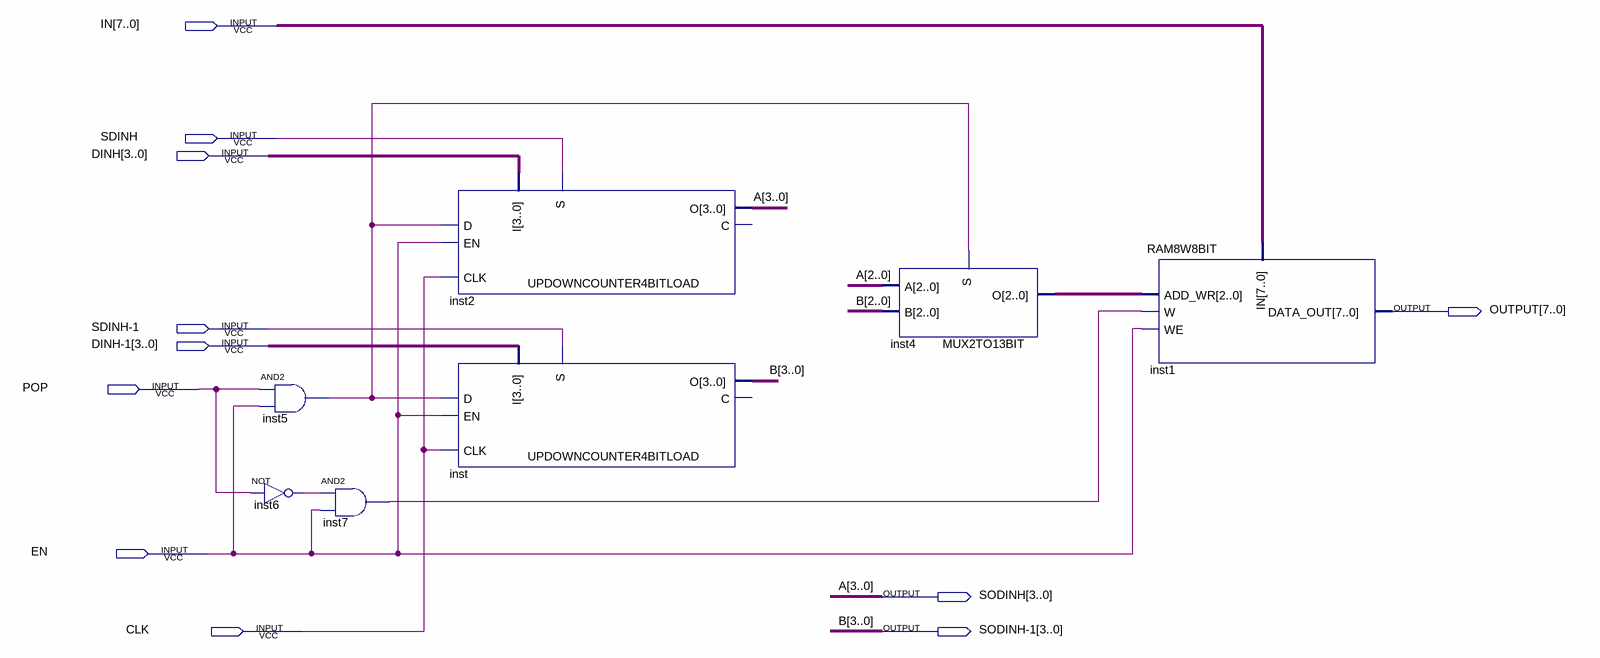
[diagram p0: schematic sheet]
// Quartus schematic STACKRAM.bdf as structural Verilog: 7 symbols, 11 pins
module STACKRAM (
  input  [7:0] IN,
  input  SDINH,
  input  [3:0] DINH,
  input  \SDINH-1 ,
  input  [3:0] \DINH-1 ,
  input  POP,
  input  EN,
  input  CLK,
  output [7:0] OUTPUT,
  output [3:0] SODINH,
  output [3:0] \SODINH-1 
);

  wire inst5_out, inst6_out, inst7_out;
  wire [2:0] inst4_o;

  and inst5 (inst5_out, POP, EN);
  not inst6 (inst6_out, POP);
  and inst7 (inst7_out, inst6_out, EN);
  UPDOWNCOUNTER4BITLOAD inst2 (.I(DINH), .S(SDINH), .EN(EN), .D(inst5_out), .CLK(CLK), .O(SODINH));  // open: C
  UPDOWNCOUNTER4BITLOAD inst (
    .I(\DINH-1 ), .S(\SDINH-1 ), .EN(EN), .D(inst5_out), .CLK(CLK), .O(\SODINH-1 ));  // open: C
  MUX2TO13BIT inst4 (.S(inst5_out), .A(SODINH[2:0]), .B(\SODINH-1 [2:0]), .O(inst4_o));
  RAM8W8BIT inst1 (.W(inst7_out), .IN(IN), .ADD_WR(inst4_o), .WE(EN), .DATA_OUT(OUTPUT));

  // Other names for the same wires on the sheet: A[3:0] = SODINH; B[3:0] = \SODINH-1 
endmodule
